# EAGLE schematic DAC_GainOutputStage4 (EAGLE 9.6.2)
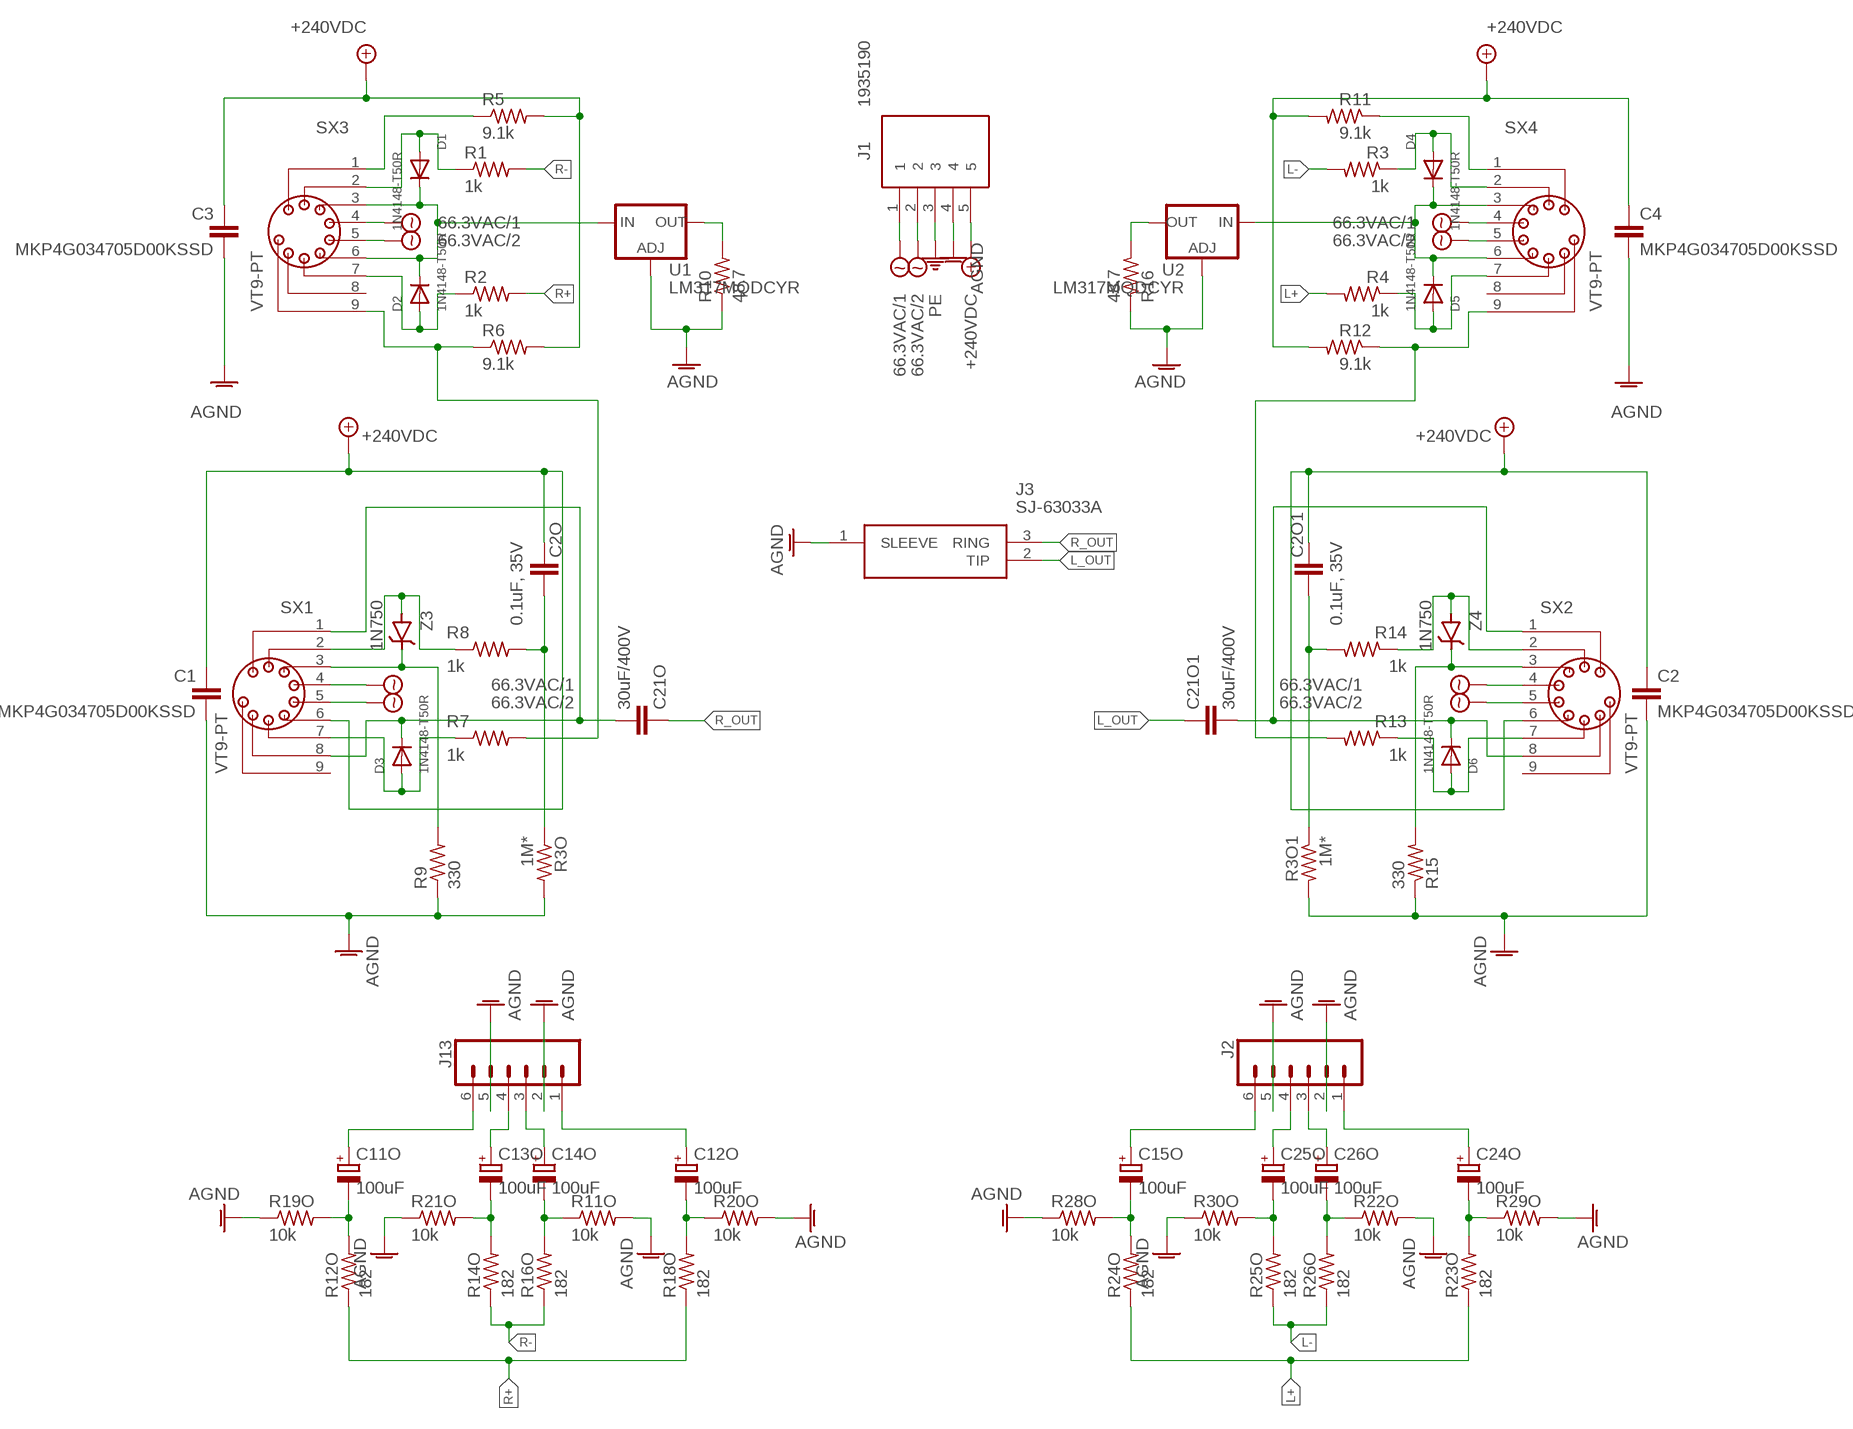
[diagram p0: schematic, sheet 1]

## Parts
C1  MKP4G034705D00KSSD  [MKP4G034705D00KSSD]
C2  MKP4G034705D00KSSD  [MKP4G034705D00KSSD]
C2O  0.1uF, 35V  MKS4B031002A00JC00  [MKS4B031002A00JC00]
C2O1  0.1uF, 35V  MKS4B031002A00JC00  [MKS4B031002A00JC00]
C3  MKP4G034705D00KSSD  [MKP4G034705D00KSSD]
C4  MKP4G034705D00KSSD  [MKP4G034705D00KSSD]
C11O  100uF  UFW1H101MPD1TD  [CAPPRD350W60D825H1300]
C12O  100uF  UFW1H101MPD1TD  [CAPPRD350W60D825H1300]
C13O  100uF  UFW1H101MPD1TD  [CAPPRD350W60D825H1300]
C14O  100uF  UFW1H101MPD1TD  [CAPPRD350W60D825H1300]
C15O  100uF  UFW1H101MPD1TD  [CAPPRD350W60D825H1300]
C21O  30uF/400V  DCP4G053006ID2KSSD  [DCP4G053006ID2KSSD]
C21O1  30uF/400V  DCP4G053006ID2KSSD  [DCP4G053006ID2KSSD]
C24O  100uF  UFW1H101MPD1TD  [CAPPRD350W60D825H1300]
C25O  100uF  UFW1H101MPD1TD  [CAPPRD350W60D825H1300]
C26O  100uF  UFW1H101MPD1TD  [CAPPRD350W60D825H1300]
D1  1N4148-T50R  [DIOAD1068W53L380D172]
D2  1N4148-T50R  [DIOAD1068W53L380D172]
D3  1N4148-T50R  [DIOAD1068W53L380D172]
D4  1N4148-T50R  [DIOAD1068W53L380D172]
D5  1N4148-T50R  [DIOAD1068W53L380D172]
D6  1N4148-T50R  [DIOAD1068W53L380D172]
J1  1935190  [1935190]
J2  CONN_06SILK_FEMALE_PTH  [1X06]
J3  SJ-63033A  [SJ63033A]
J13  CONN_06SILK_FEMALE_PTH  [1X06]
R1  1k  LR1F1K0  [0207/10]
R2  1k  LR1F1K0  [0207/10]
R3  1k  LR1F1K0  [0207/10]
R3O  1M*  LR1F1M0  [0207/10]
R3O1  1M*  LR1F1M0  [0207/10]
R4  1k  LR1F1K0  [0207/10]
R5  9.1k  PR02000209101FA100  [0411/15]
R6  9.1k  PR02000209101FA100  [0411/15]
R7  1k  LR1F1K0  [0207/10]
R8  1k  LR1F1K0  [0207/10]
R9  330  LR1F330R  [0207/10]
R10  48.7  RN55D48R7FB14  [0207/10]
R11  9.1k  PR02000209101FA100  [0411/15]
R11O  10k  LR1F10K  [0207/10]
R12  9.1k  PR02000209101FA100  [0411/15]
R12O  182  MF0207FTE52-182R  [0207/10]
R13  1k  LR1F1K0  [0207/10]
R14  1k  LR1F1K0  [0207/10]
R14O  182  MF0207FTE52-182R  [0207/10]
R15  330  LR1F330R  [0207/10]
R16  48.7  RN55D48R7FB14  [0207/10]
R16O  182  MF0207FTE52-182R  [0207/10]
R18O  182  MF0207FTE52-182R  [0207/10]
R19O  10k  LR1F10K  [0207/10]
R20O  10k  LR1F10K  [0207/10]
R21O  10k  LR1F10K  [0207/10]
R22O  10k  LR1F10K  [0207/10]
R23O  182  MF0207FTE52-182R  [0207/10]
R24O  182  MF0207FTE52-182R  [0207/10]
R25O  182  MF0207FTE52-182R  [0207/10]
R26O  182  MF0207FTE52-182R  [0207/10]
R28O  10k  LR1F10K  [0207/10]
R29O  10k  LR1F10K  [0207/10]
R30O  10k  LR1F10K  [0207/10]
SX1  VT9-PT  [VT9-PT]
SX2  VT9-PT  [VT9-PT]
SX3  VT9-PT  [VT9-PT]
SX4  VT9-PT  [VT9-PT]
U1  LM317MQDCYR  [SOT230P700X180-4N]
U2  LM317MQDCYR  [SOT230P700X180-4N]
Z3  1N750  [DIOAD1256W56L444D203]
Z4  1N750  [DIOAD1256W56L444D203]

## Nets
66.3VAC/1 [Power]: J1.1 SX1.4 SX2.4 SX3.4 SX4.4
66.3VAC/2 [Power]: J1.2 SX1.5 SX2.5 SX3.5 SX4.5
+240VDC [Power]: C1.1 C2.1 C2O1.1 C2O.1 C3.1 C4.1 J1.5 R5.2 R6.2 R11.2 R12.2 SX1.6 SX2.6
AGND [Power]: C1.2 C2.2 C3.2 C4.2 J1.4 J2.2 J2.5 J3.1(SLEEVE) J13.2 J13.5 R3O1.2 R3O.2 R9.1 R10.1 R11O.2 R15.1 R16.1 R19O.1 R20O.2 R21O.1 R22O.2 R28O.1 R29O.2 R30O.1 U1.1(ADJ) U2.1(ADJ)
L+ [Signal]: R4.2 R23O.1 R24O.1
L- [Signal]: R3.2 R25O.1 R26O.1
L_OUT [Signal]: C21O1.1 J3.2(TIP)
N$1: R6.1 R7.2 SX3.9
N$2: R8.1 SX1.2 Z3.2(A)
N$3: C21O1.2 D6.1(C) SX2.1 SX2.8
N$4: D4.2(A) R3.1 SX4.2
N$5: D5.2(A) R4.1 SX4.7
N$6: D1.2(A) R1.1 SX3.2
N$7 [Power]: D4.1(C) D5.1(C) SX4.3 SX4.6 U2.3(IN)
N$8: R11.1 SX4.1
N$9: R12.1 R13.2 SX4.9
N$10: C11O.1(+) J13.6
N$11: C11O.2(-) R12O.2 R19O.2
N$12: C15O.1(+) J2.6
N$13: D2.2(A) R2.1 SX3.7
N$14: R14.1 SX2.2 Z4.2(A)
N$15: C12O.1(+) J13.1
N$16: C2O.2 R3O.1 R8.2
N$17: C2O1.2 R3O1.1 R14.2
N$18: C21O.2 D3.1(C) SX1.1 SX1.8
N$19: C12O.2(-) R18O.2 R20O.1
N$20: C15O.2(-) R24O.2 R28O.2
N$21: C13O.1(+) J13.4
N$22 [Power]: D1.1(C) D2.1(C) SX3.3 SX3.6 U1.3(IN)
N$23: D3.2(A) R7.1 SX1.7
N$24: C14O.1(+) J13.3
N$25: C14O.2(-) R11O.1 R16O.2
N$26: R9.2 SX1.3 Z3.1(C)
N$27: R15.2 SX2.3 Z4.1(C)
N$28: C13O.2(-) R14O.2 R21O.2
N$29: D6.2(A) R13.1 SX2.7
N$30: C24O.1(+) J2.1
N$31: C24O.2(-) R23O.2 R29O.1
N$32: C25O.1(+) J2.4
N$33: C26O.1(+) J2.3
N$34: C26O.2(-) R22O.1 R26O.2
N$35: R5.1 SX3.1
N$36: C25O.2(-) R25O.2 R30O.2
N$37: R10.2 U1.2(OUT) U1.4(OUT)
N$38: R16.2 U2.2(OUT) U2.4(OUT)
PE [Power]: J1.3
R+ [Signal]: R2.2 R12O.1 R18O.1
R- [Signal]: R1.2 R14O.1 R16O.1
R_OUT [Signal]: C21O.1 J3.3(RING)
Unconnected: SX1.9 SX2.9 SX3.8 SX4.8

## Library data of the parts
C1-C4 = Dual Mono Amp Library:MKP4G034705D00KSSD: 0.47 F Film Capacitor 220V 400V Polypropylene (PP), Metallized Radial Source: Datasheet <https://www.wima.de/wp-content/uploads/media/e_WIMA_MKP_4.pdf>; DESCRIPTION: 0.47 F Film Capacitor 220V 400V Polypropylene (PP), Metallized Radial; HEIGHT: 16.5mm; MANUFACTURER_NAME: WIMA; MANUFACTURER_PART_NUMBER: MKP4G034705D00KSSD; MOUSER_PART_NUMBER: 505-MKP4G034705DKSSD; MOUSER_PRICE-STOCK: http://www.mouser.com/Search/ProductDetail.aspx?qs=sJjjjplDs9uaOctv9bTMfA%3d%3d
C2O C2O1 = Dual Mono Amp Library:MKS4B031002A00JC00: Film Capacitors MKS 4 0.1 uF 50 VDC 2.5x7x10 PCM 7.5 Source: Datasheet <https://www.wima.de/wp-content/uploads/media/e_WIMA_MKS_4.pdf>; DESCRIPTION: Film Capacitors MKS 4 0.1 uF 50 VDC 2.5x7x10 PCM 7.5; HEIGHT: 7mm; MANUFACTURER_NAME: WIMA; MANUFACTURER_PART_NUMBER: MKS4B031002A00JC00; MOUSER_PART_NUMBER: 505-MKS4B0312AJC; MOUSER_PRICE-STOCK: https://www.mouser.co.uk/ProductDetail/WIMA/MKS4B031002A00JC00?qs=2G4irm%2FqADy9MV8AUfKNYA%3D%3D
C11O C12O C13O C14O C15O C24O C25O C26O = Dual Mono Amp Library:UFW1H101MPD1TD: Aluminum Electrolytic Capacitors - Radial Leaded 100uF 50 Volts 20% Source: Datasheet <https://www.nichicon.co.jp/english/series_items/catalog_pdf/e-ufw.pdf>; ARROW_PART_NUMBER: UFW1H101MPD1TD; ARROW_PRICE-STOCK: https://www.arrow.com/en/products/ufw1h101mpd1td/nichicon; DESCRIPTION: Aluminum Electrolytic Capacitors - Radial Leaded 100uF 50 Volts 20%; HEIGHT: 13mm; MANUFACTURER_NAME: Nichicon; MANUFACTURER_PART_NUMBER: UFW1H101MPD1TD; MOUSER_PART_NUMBER: 647-UFW1H101MPD1TD; MOUSER_PRICE-STOCK: https://www.mouser.co.uk/ProductDetail/Nichicon/UFW1H101MPD1TD?qs=WJSLByB5Mu30jPPJ2KiG3A%3D%3D
C21O C21O1 = Dual Mono Amp Library:DCP4G053006ID2KSSD: Film Capacitors DC-LINK MKP 4 30.0 uF 400 VDC 17x34.5x31.5 PCM 27.5 Source: Datasheet <https://www.wima.de/wp-content/uploads/media/e_WIMA_DC_Link_MKP_4.pdf>; DESCRIPTION: Film Capacitors DC-LINK MKP 4 30.0 uF 400 VDC 17x34.5x31.5 PCM 27.5; HEIGHT: 34.5mm; MANUFACTURER_NAME: WIMA; MANUFACTURER_PART_NUMBER: DCP4G053006ID2KSSD; MOUSER_PART_NUMBER: 505-DCP4G0536ID2KSSD; MOUSER_PRICE-STOCK: https://www.mouser.co.uk/ProductDetail/WIMA/DCP4G053006ID2KSSD?qs=RB4whv9F6rwxZ2Ey0tRejg%3D%3D
D1-D6 = Dual Mono Amp Library:1N4148-T50R: Diodes - General Purpose, Power, Switching Hi Conductance Fast Source: Datasheet <https://www.onsemi.com/pub/Collateral/1N914-D.PDF>; DESCRIPTION: Diodes - General Purpose, Power, Switching Hi Conductance Fast; HEIGHT: mm; MANUFACTURER_NAME: onsemi; MANUFACTURER_PART_NUMBER: 1N4148-T50R; MOUSER_PART_NUMBER: 512-1N4148T50R; MOUSER_PRICE-STOCK: https://www.mouser.co.uk/ProductDetail/onsemi-Fairchild/1N4148-T50R?qs=0lQeLiL1qyZS6rosZp7Ehg%3D%3D
J1 = Dual Mono Amp Library:1935190: PCB terminal block, nominal current: 17.5 A, rated voltage (III/2): 400 V, nominal cross section: 1.5 mm?, Number of potentials: 5, Number of rows: 1, Number of positions per row: 5, product range: PT 1,5/..-H, pitch: 5 mm, connection method: Screw connection with wire protector, mounting: Wave soldering, conductor/PCB connection direction: 0 ?, color: green, Pin layout: Linear pinning, Solder pin [P]: 3.5 mm, type of packaging: packed in cardboard Source: Datasheet <https://www.phoenixcontact.com/online/portal/us/pxc/product_detail_page/!ut/p/z1/3Vdbc5pAFP4r5sG3rLsLLEJn-oDGlJjEYsQqvDDssma24RZETf31Xbyk1Wn1IeN0CnNm2D2c853L8jEc6MMp9NNwKZ7DUmRpGMu95-uB23F7PUfR8dch6aC7G9LtPWhP2B4o8Bv0oV-GFHq4WsWCFmHxA3qLOU8rRS4i-chUCTZRtc>; DESCRIPTION: PCB terminal block, nominal current: 17.5 A, rated voltage (III/2): 400 V, nominal cross section: 1.5 mm?, Number of potentials: 5, Number of rows: 1, Number of positions per row: 5, product range: PT 1,5/..-H, pitch: 5 mm, connection method: Screw connection with wire protector, mounting: Wave soldering, conductor/PCB connection direction: 0 ?, color: green, Pin layout: Linear pinning, Solder pin [P]: 3.5 mm, type of packaging: packed in cardboard; HEIGHT: 11.55mm; MANUFACTURER_NAME: Phoenix Contact; MANUFACTURER_PART_NUMBER: 1935190; MOUSER_PART_NUMBER: 651-1935190; MOUSER_PRICE-STOCK: https://www.mouser.co.uk/ProductDetail/Phoenix-Contact/1935190?qs=QWULklcAmSS%2FS46GSzyZOw%3D%3D
J2 J13 = Dual Mono Amp Library:CONN_06: Multi connection point. Often used as Generic Header-pin footprint for 0.1 inch spaced/style header connections On any of the 0.1 inch spaced packages, you can populate with these: Break Away Headers - Straight <https://www.sparkfun.com/products/116> (PRT-00116) Break Away Male Headers - Right Angle <https://www.sparkfun.com/products/553> (PRT-00553) Female Headers <https://www.sparkfun.com/products/115> (PRT-00115) Break Away Headers - Machine Pin <https://www.sparkfun.com/products/117> (PRT-00117) Break Away Female Headers - Swiss Machine Pin <https://www.sparkfun.com/products/743> (PRT-00743) Arduino Stackable Header - 6 Pin <https://www.sparkfun.com/products/9280> (PRT-09280) Screw Terminals 2.54mm Pitch (6-Pin) <https://www.sparkfun.com/products/16499> (PRT-16499) For SCREWTERMINALS and SPRING TERMINALS visit here: Screw Terimnals on SparkFun.com <https://www.sparkfun.com/search/results?term=Screw+Terminals> (5mm/3.5mm/2.54mm spacing) This device is also useful as a general connection point to wire up your design to another part of your project. Our various solder wires solder well into these plated through hole pads. Hook-Up Wire - Assortment (Stranded, 22 AWG) <https://www.sparkfun.com/products/11375> (PRT-11375) Hook-Up Wire - Assortment (Solid Core, 22 AWG) <https://www.sparkfun.com/products/11367> (PRT-11367) View the entire wire category on our website here <https://www.sparkfun.com/categories/141>; PROD_ID: CONN-08437
J3 = Dual Mono Amp Library:SJ-63033A: 6.35 mm, Stereo, Right Angle, Through Hole Mount, 3 Conductors, 0 Internal Switches, Audio Jack Connector Source: Datasheet <https://www.cuidevices.com/product/resource/sj-63033a.pdf>; DESCRIPTION: 6.35 mm, Stereo, Right Angle, Through Hole Mount, 3 Conductors, 0 Internal Switches, Audio Jack Connector; HEIGHT: 12.3mm; MANUFACTURER_NAME: CUI Devices; MANUFACTURER_PART_NUMBER: SJ-63033A
R1-R4 R7 R8 R13 R14 = Dual Mono Amp Library:LR1F1K0: Body Features: Lead Type Axial-Leaded | Configuration Features: Number of Resistors 1 | Dimensions: Passive Component Dimensions 6.2 x 2.3 MM | Electrical Characteristics: Passive Component Tolerance 1 PCT | Resistance Value 1K OHM | Operating Voltage 350 V | Power Rating .6 WATT | Resistance Class 1k 1M | Packaging Features: Packaging Method Ammo Packed | Product Type Features: Element Type Thin Film | Resistor Type General Purpose Resistor | Termination Features: Termination Area Base Material Cop Source: Datasheet <https://www.te.com/commerce/DocumentDelivery/DDEController?Action=srchrtrv&DocNm=1773241&DocType=Data Sheet&DocLang=English&PartCntxt=1622349-1&DocFormat=pdf>; DESCRIPTION: Body Features: Lead Type Axial-Leaded | Configuration Features: Number of Resistors 1 | Dimensions: Passive Component Dimensions 6.2 x 2.3 MM | Electrical Characteristics: Passive Component Tolerance 1 PCT | Resistance Value 1K OHM | Operating Voltage 350 V | Power Rating .6 WATT | Resistance Class 1k 1M | Packaging Features: Packaging Method Ammo Packed | Product Type Features: Element Type Thin Film | Resistor Type General Purpose Resistor | Termination Features: Termination Area Base Material Cop; HEIGHT: mm; MANUFACTURER_NAME: TE Connectivity; MANUFACTURER_PART_NUMBER: LR1F1K0; MOUSER_PART_NUMBER: 279-LR1F1K0; MOUSER_PRICE-STOCK: https://www.mouser.co.uk/ProductDetail/TE-Connectivity-Holsworthy/LR1F1K0?qs=ip69W3eHERVhMxNSZkerTg%3D%3D
R3O R3O1 = Dual Mono Amp Library:LR1F1M0: TE Connectivity Axial Metal Film Resistor 1m +/-1% 0.6W +/-50ppm/C Source: Datasheet <https://www.te.com/commerce/DocumentDelivery/DDEController?Action=showdoc&DocId=Data Sheet1773241GpdfEnglishENG_DS_1773241_G.pdf1622367-1>; DESCRIPTION: TE Connectivity Axial Metal Film Resistor 1m +/-1% 0.6W +/-50ppm/C; HEIGHT: mm; MANUFACTURER_NAME: TE Connectivity; MANUFACTURER_PART_NUMBER: LR1F1M0; MOUSER_PART_NUMBER: 279-LR1F1M0; MOUSER_PRICE-STOCK: https://www.mouser.co.uk/ProductDetail/TE-Connectivity-Holsworthy/LR1F1M0?qs=ip69W3eHERVt%2FmQVAugcSg%3D%3D
R5 R6 R11 R12 = Dual Mono Amp Library:PR02000209101FA100: VISHAY - PR02000209101FA100 - Through Hole Resistor, 9.1 kohm, PR02 Series, 2 W, +/- 5%, Axial Leaded, 500 V Source: Datasheet <https://www.vishay.com/doc?28729>; DESCRIPTION: VISHAY - PR02000209101FA100 - Through Hole Resistor, 9.1 kohm, PR02 Series, 2 W, +/- 5%, Axial Leaded, 500 V; HEIGHT: mm; MANUFACTURER_NAME: Vishay; MANUFACTURER_PART_NUMBER: PR02000209101FA100; MOUSER_PART_NUMBER: 594-PR02000209101FA1; MOUSER_PRICE-STOCK: https://www.mouser.com/ProductDetail/Vishay-BC-Components/PR02000209101FA100?qs=sGAEpiMZZMtlubZbdhIBILAdz%2F2y2rDs5x9O1ZBVKlg%3D
R9 R15 = Dual Mono Amp Library:LR1F330R: Body Features: Lead Type Axial-Leaded | Configuration Features: Number of Resistors 1 | Dimensions: Passive Component Dimensions 6.2 x 2.3 MM | Electrical Characteristics: Resistance Value 330 OHM | Power Rating .6 WATT | Passive Component Tolerance 1 PCT | Operating Voltage 350 V | Resistance Class Up to 1k | Packaging Features: Packaging Method Ammo Packed | Product Type Features: Resistor Type General Purpose Resistor | Element Type Thin Film | Termination Features: Number of Terminations 2 | Terminati Source: Datasheet <https://www.te.com/commerce/DocumentDelivery/DDEController?Action=srchrtrv&DocNm=1773241&DocType=Data Sheet&DocLang=English&PartCntxt=1622438-1&DocFormat=pdf>; DESCRIPTION: Body Features: Lead Type Axial-Leaded | Configuration Features: Number of Resistors 1 | Dimensions: Passive Component Dimensions 6.2 x 2.3 MM | Electrical Characteristics: Resistance Value 330 OHM | Power Rating .6 WATT | Passive Component Tolerance 1 PCT | Operating Voltage 350 V | Resistance Class Up to 1k | Packaging Features: Packaging Method Ammo Packed | Product Type Features: Resistor Type General Purpose Resistor | Element Type Thin Film | Termination Features: Number of Terminations 2 | Terminati; HEIGHT: mm; MANUFACTURER_NAME: TE Connectivity; MANUFACTURER_PART_NUMBER: LR1F330R; MOUSER_PART_NUMBER: 279-LR1F330R; MOUSER_PRICE-STOCK: https://www.mouser.co.uk/ProductDetail/TE-Connectivity-Holsworthy/LR1F330R?qs=ip69W3eHERU18wOSJKTVaQ%3D%3D
R10 R16 = Dual Mono Amp Library:RN55D48R7FB14: Metal Film Resistors - Through Hole 1/8watt 48.7ohms 1% 100ppm Source: Datasheet <https://www.vishay.com/doc?31027>; DESCRIPTION: Metal Film Resistors - Through Hole 1/8watt 48.7ohms 1% 100ppm; HEIGHT: mm; MANUFACTURER_NAME: Vishay; MANUFACTURER_PART_NUMBER: RN55D48R7FB14; MOUSER_PART_NUMBER: 71-RN55D-F-48.7; MOUSER_PRICE-STOCK: https://www.mouser.com/ProductDetail/Vishay-Dale/RN55D48R7FB14?qs=sGAEpiMZZMsPqMdJzcrNwqLSjlxN7Le6H%2Fnooot2Cxw%3D
R11O R19O R20O R21O R22O R28O R29O R30O = Dual Mono Amp Library:LR1F10K: Metal film resistor, 10K 0.6W TE Connectivity LR1F Series Axial Metal Film Resistor 10k Source: Datasheet <https://datasheet.datasheetarchive.com/originals/distributors/DKDS-21/401716.pdf>; DESCRIPTION: Metal film resistor, 10K 0.6W TE Connectivity LR1F Series Axial Metal Film Resistor 10k; HEIGHT: mm; MANUFACTURER_NAME: TE Connectivity; MANUFACTURER_PART_NUMBER: LR1F10K; MOUSER_PART_NUMBER: 279-LR1F10K; MOUSER_PRICE-STOCK: https://www.mouser.co.uk/ProductDetail/TE-Connectivity-Holsworthy/LR1F10K?qs=ip69W3eHERWDLLWs2Qv0Lg%3D%3D
R12O R14O R16O R18O R23O R24O R25O R26O = Dual Mono Amp Library:MF0207FTE52-182R: Metal Film Resistors - Through Hole 0.6W 1% 182 ohm 50pp m Source: Datasheet <https://www.mouser.com/datasheet/2/447/YAGEO_MF0_datasheet_2021v1-3003020.pdf>; DESCRIPTION: Metal Film Resistors - Through Hole 0.6W 1% 182 ohm 50pp m; HEIGHT: mm; MANUFACTURER: Yageo; MANUFACTURER_PART_NUMBER: MF0207FTE52-182R; MOUSER_PART_NUMBER: 603-MF0207FTE52-182R; MOUSER_PRICE-STOCK: https://www.mouser.com/ProductDetail/YAGEO/MF0207FTE52-182R?qs=KUIzHt%2Fe91leK267FaM40g%3D%3D
SX1-SX4 = Dual Mono Amp Library:VT9: VACUUM TUBE SOCKET Source: 00004280-VT9-PT.pdf
U1 U2 = Dual Mono Amp Library:LM317MQDCYR: Standard Regulator 1.25V to 37V 0.5A Texas Instruments LM317MQDCYR, Single Linear Voltage Regulator, 500mA Adjustable 1.25 37 V, 4-Pin SOT-223 Source: Datasheet <https://componentsearchengine.com/Datasheets/2/LM317MQDCYR.pdf>; DESCRIPTION: Standard Regulator 1.25V to 37V 0.5A Texas Instruments LM317MQDCYR, Single Linear Voltage Regulator, 500mA Adjustable 1.25 37 V, 4-Pin SOT-223; HEIGHT: 1.8mm; MANUFACTURER_NAME: Texas Instruments; MANUFACTURER_PART_NUMBER: LM317MQDCYR; MOUSER_PART_NUMBER: 595-LM317MQDCYR; MOUSER_PRICE-STOCK: https://www.mouser.co.uk/ProductDetail/Texas-Instruments/LM317MQDCYR?qs=VBduBm9rCJSAPGr9YDjocQ%3D%3D
Z3 Z4 = Dual Mono Amp Library:1N750: Zener Diodes Voltage Regulator Source: Datasheet <https://www.microsemi.com/document-portal/doc_view/10928-sa5-7-datasheet>; DESCRIPTION: Zener Diodes Voltage Regulator; HEIGHT: mm; MANUFACTURER_NAME: Microsemi Corporation; MANUFACTURER_PART_NUMBER: 1N750; MOUSER_PART_NUMBER: 494-1N750(DO-35); MOUSER_PRICE-STOCK: https://www.mouser.co.uk/ProductDetail/Microchip-Microsemi/1N750?qs=Xwz%252BGKGy4sB1rzIdx4SmVg%3D%3D

## Net classes
1 Signal: width 1.272 mm
2 Power: width 2.54 mm